# EAGLE design BMS Thermistor ECU rev2 (EAGLE 8.3.1)
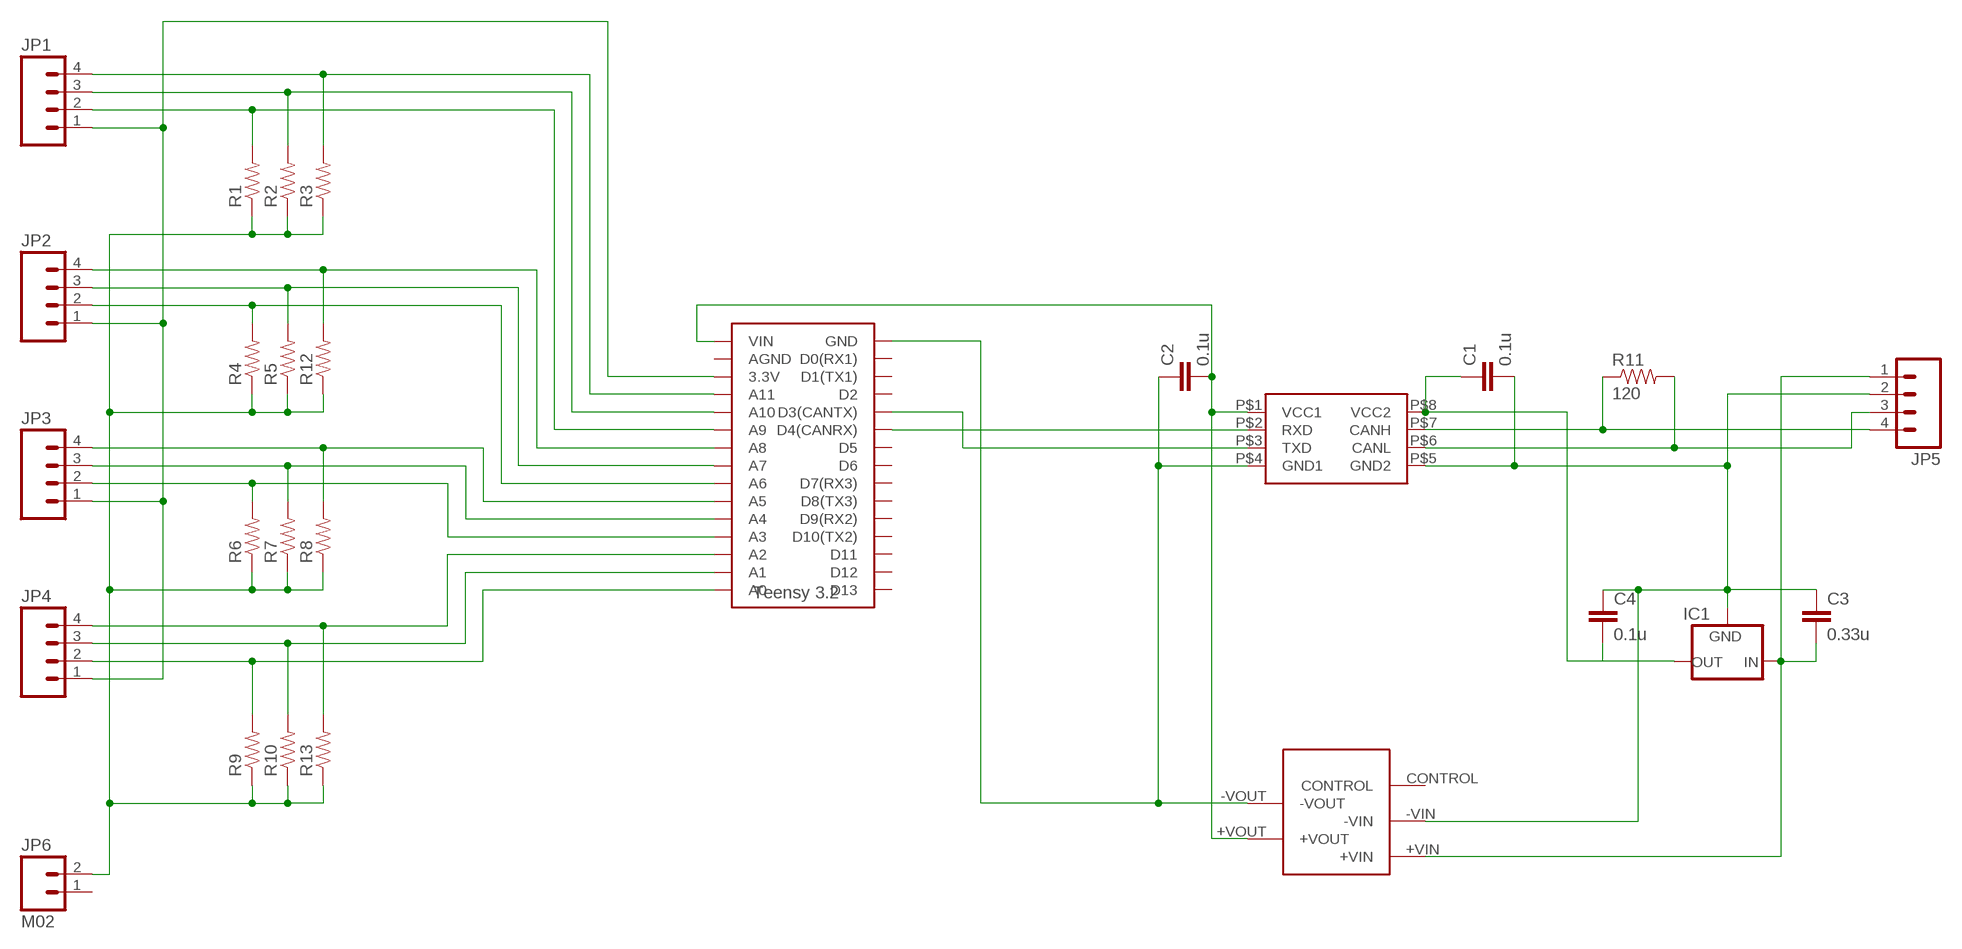
[diagram p0: schematic, sheet 1]

## Parts
C1  0.1u  CAP0805  [0805]
C2  0.1u  CAP0805  [0805]
C3  0.33u  CAP0805  [0805]
C4  0.1u  CAP0805  [0805]
IC1  5VREG_L7805SPACED  [TO-220-SPACED]
JP1  M04  [1X04]
JP2  M04  [1X04]
JP3  M04  [1X04]
JP4  M04  [1X04]
JP5  M04  [1X04]
JP6  M02  [1X02]
R1  RESISTOR0805-RES  [0805]
R2  RESISTOR0805-RES  [0805]
R3  RESISTOR0805-RES  [0805]
R4  RESISTOR0805-RES  [0805]
R5  RESISTOR0805-RES  [0805]
R6  RESISTOR0805-RES  [0805]
R7  RESISTOR0805-RES  [0805]
R8  RESISTOR0805-RES  [0805]
R9  RESISTOR0805-RES  [0805]
R10  RESISTOR0805-RES  [0805]
R11  120  RESISTOR0805-RES  [0805]
R12  RESISTOR0805-RES  [0805]
R13  RESISTOR0805-RES  [0805]
U$1  TEENSY_3.2_12ANALOG  [TEENSY_3.2_12ANALOG]
U$2  ISO1050CAN  [DUB8]
U$3  NCS1S1205SC-12V-5VCONVERTER  [DCDC-CONVERTER]

## Nets
3.3V: JP1.1 JP2.1 JP3.1 JP4.1 U$1.3.3V
N$1: C1.2 C3.1 C4.1 IC1.2(GND) JP5.2 U$2.P$5(GND2) U$3.-VIN
N$2: JP3.3 R7.2 U$1.A4
N$3: JP3.4 R8.2 U$1.A5
N$4: C3.2 IC1.1(IN) JP5.1 U$3.+VIN
N$5: C1.1 C4.2 IC1.3(OUT) U$2.P$8(VCC2)
N$6: JP5.4 R11.1 U$2.P$7(CANH)
N$7: JP5.3 R11.2 U$2.P$6(CANL)
N$8: U$1.D3(CANTX) U$2.P$3(TXD)
N$9: U$1.D4(CANRX) U$2.P$2(RXD)
N$10: C2.2 U$1.VIN U$2.P$1(VCC1) U$3.+VOUT
N$11: C2.1 U$1.GND U$2.P$4(GND1) U$3.-VOUT
N$12: JP2.4 R12.2 U$1.A8
N$13: JP4.4 R13.2 U$1.A2
THERM1: JP1.2 R1.2 U$1.A9
THERM2: JP1.3 R2.2 U$1.A10
THERM3: JP1.4 R3.2 U$1.A11
THERM4: JP2.2 R4.2 U$1.A6
THERM5: JP2.3 R5.2 U$1.A7
THERM6: JP3.2 R6.2 U$1.A3
THERM9: JP4.2 R9.2 U$1.A0
THERM10: JP4.3 R10.2 U$1.A1
TS_GND: JP6.2 R1.1 R2.1 R3.1 R4.1 R5.1 R6.1 R7.1 R8.1 R9.1 R10.1 R12.1 R13.1
Unconnected: JP6.1 U$1.AGND U$1.D0(RX1) U$1.D1(TX1) U$1.D2 U$1.D5 U$1.D6 U$1.D7(RX3) U$1.D8(TX3) U$1.D9(RX2) U$1.D10(TX2) U$1.D11 U$1.D12 U$1.D13 U$3.CONTROL

## Library data of the parts
C1-C4 = HyTechDevices:CAP: Capacitor Standard 0603 ceramic capacitor, and 0.1" leaded capacitor.
IC1 = HyTechDevices:5VREG_L7805: Voltage Regulator Switching 5v regulator Datasheet <http://power.murata.com/data/power/oki-78sr.pdf> Standard 7805 5V regulator. IGO (Input Ground Output). Spark Fun Electronics SKU : COM-00107 Datasheet <http://www.mouser.com/ds/2/308/MC7800-D-94905.pdf>
JP1-JP5 = HyTechDevices:M04: Standard 4-pin 0.1" header. NOTES ON THE VARIANTS LOCK and LOCK_LONGPADS... This footprint was designed to help hold the alignment of a through-hole component (i.e. 6-pin header) while soldering it into place. You may notice that each hole has been shifted either up or down by 0.005 of an inch from it's more standard position (which is a perfectly straight line). This slight alteration caused the pins (the squares in the middle) to touch the edges of the holes. Because they are alternating, it causes a "brace" to hold the component in place. 0.005 has proven to be the perfect amount of "off-center" position when using our standard breakaway headers. Although looks a little odd when you look at the bare footprint, once you have a header in there, the alteration is very hard to notice. Also,if you push a header all the way into place, it is covered up entirely on the bottom side. This idea of altering the position of holes to aid alignment will be further integrated into the Sparkfun Library for other footprints. It can help hold any component with 3 or more connection pins. Note: The Sparkfun version includes many other packages including surface mount that may be of future interest. Source: Sparkfun <https://github.com/sparkfun/SparkFun-Eagle-Libraries>
JP6 = HyTechDevices:M02: Standard 2-pin 0.1" header. NOTES ON THE VARIANTS LOCK and LOCK_LONGPADS... This footprint was designed to help hold the alignment of a through-hole component (i.e. 6-pin header) while soldering it into place. You may notice that each hole has been shifted either up or down by 0.005 of an inch from it's more standard position (which is a perfectly straight line). This slight alteration caused the pins (the squares in the middle) to touch the edges of the holes. Because they are alternating, it causes a "brace" to hold the component in place. 0.005 has proven to be the perfect amount of "off-center" position when using our standard breakaway headers. Although looks a little odd when you look at the bare footprint, once you have a header in there, the alteration is very hard to notice. Also,if you push a header all the way into place, it is covered up entirely on the bottom side. This idea of altering the position of holes to aid alignment will be further integrated into the Sparkfun Library for other footprints. It can help hold any component with 3 or more connection pins. Note: The Sparkfun version includes many other packages including surface mount that may be of future interest. Source: Sparkfun <https://github.com/sparkfun/SparkFun-Eagle-Libraries>
R1-R13 = HyTechDevices:RESISTOR: Resistor Basic schematic elements and footprints for 0603, 1206, and PTH resistors.
U$1 = HyTechDevices:TEENSY_3.2_12ANALOG
U$2 = HyTechDevices:ISO1050CAN
U$3 = HyTechDevices:NCS1S1205SC-12V-5VCONVERTER

## Board
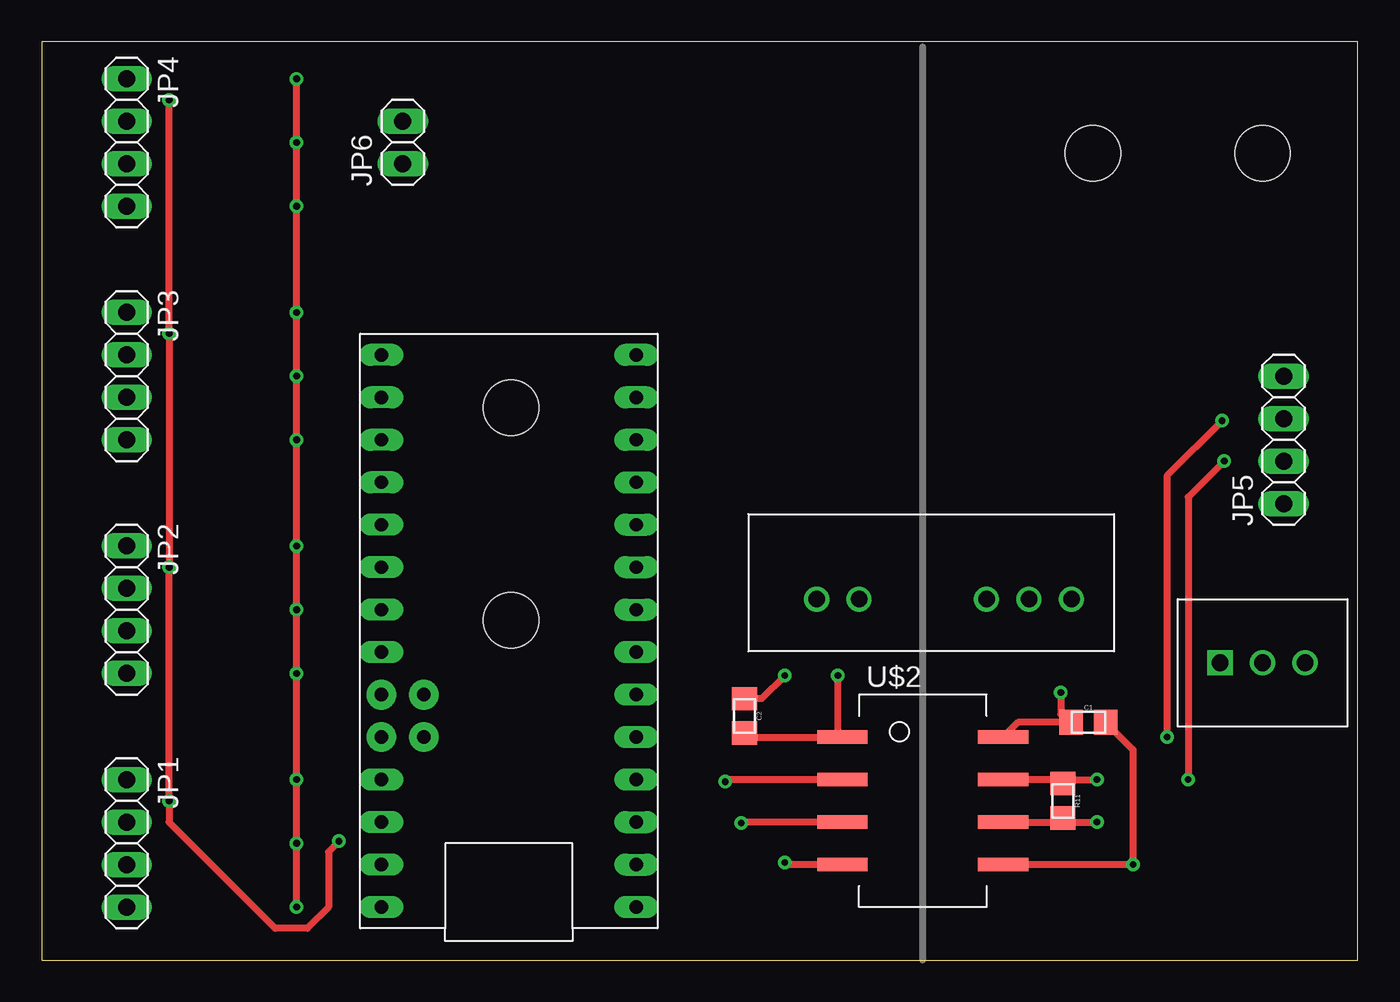
[diagram p1: board, top side]
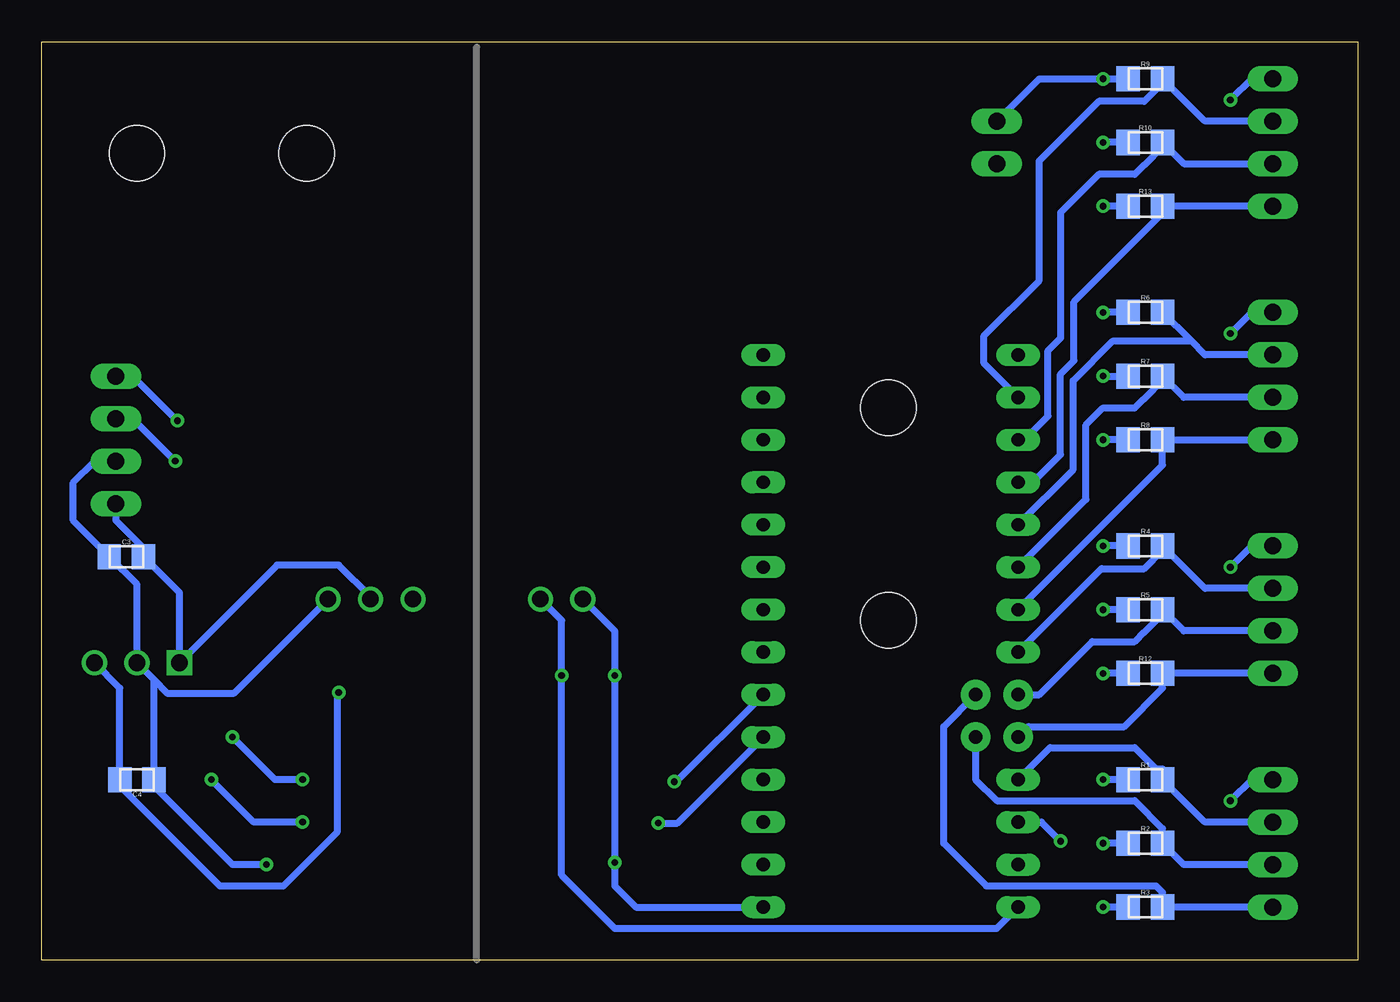
[diagram p2: board, bottom side, seen from below]

Size 78.72 x 54.91 mm. Coordinates in mm from the lower left corner, seen from the top.
Outline: 0,0 78.72,0 78.72,54.91 0,54.91 0,0
Copper layers (1*16): Top 0.035mm / dielectric 1.5mm / Bottom 0.035mm
Design rules "DRC Advanced Circuits": minimum track width 6mil, minimum drill 15mil, track to track 6mil, track to pad 6mil, pad to pad 6mil, via to via 6mil, smd to smd 6mil, copper to edge 40mil, drill to drill 6mil, minimum pad ring 10mil, minimum via ring 8mil, stop-mask expansion 4mil, vias tented up to drill 0mil, thermal gap 10mil
Holes 3.3 mm at 73.03,48.26 62.87,48.26 28.07,33.02 28.07,20.32

### Footprints (pad centres in the part's own frame; a part is rotated, then mirrored left to right if it is on the bottom)
0805 = smd 1.4 x 1.5: 1 -1.025,0; 2 1.025,0
TO-220-SPACED = drill 1 square: 1 -2.54,0 | drill 1: 2 0,0; 3 2.54,0
1X04 = drill 1.016 long: 1 -3.81,0; 2 -1.27,0; 3 1.27,0; 4 3.81,0
1X02 = drill 1.016 long: 1 -1.27,0; 2 1.27,0
TEENSY_3.2_12ANALOG = drill 0.8 long: 3.3V 16.51,29.21; A0 16.51,3.81; A1 16.51,6.35; A2 16.51,8.89; A3 16.51,11.43; A4 16.51,13.97; A5 16.51,16.51; A6 16.51,19.05; A9 16.51,26.67; AGND 16.51,31.75; D0(RX1) 1.27,31.75; D1(TX1) 1.27,29.21; D2 1.27,26.67; D3(CANTX) 1.27,24.13; D4(CANRX) 1.27,21.59; D5 1.27,19.05; D6 1.27,16.51; D7(RX3) 1.27,13.97; D8(TX3) 1.27,11.43; D9(RX2) 1.27,8.89; D10(TX2) 1.27,6.35; D11 1.27,3.81; D12 1.27,1.27; D13 16.51,1.27; GND 1.27,34.29; VIN 16.51,34.29 | drill 0.8 pad 1.778: A7 16.51,21.59; A8 16.51,24.13; A10 13.97,24.13; A11 13.97,21.59
DUB8 = smd 0.8 x 3: P$1 -3.81,-4.8; P$2 -1.27,-4.8; P$3 1.27,-4.8; P$4 3.81,-4.8; P$5 3.81,4.8; P$6 1.27,4.8; P$7 -1.27,4.8; P$8 -3.81,4.8
DCDC-CONVERTER = drill 0.991: +VIN -6.35,0; +VOUT 3.81,0; -VIN -8.89,0; -VOUT 6.35,0; CONTROL -3.81,0

### Placement (x,y rotation side)
C1  62.61,14.22 0 top
C2  42.04,14.61 270 top
C3  73.66,24.13 0 bottom
C4  73.03,10.79 180 bottom
IC1  73.03,17.78 0 top
JP1  5.08,6.99 270 top
JP2  5.08,20.95 270 top
JP3  5.08,34.92 270 top
JP4  5.08,48.9 270 top
JP5  74.3,31.11 90 top
JP6  21.59,48.9 90 top
R1  12.7,10.79 0 bottom
R2  12.7,6.99 0 bottom
R3  12.7,3.17 0 bottom
R4  12.7,24.77 0 bottom
R5  12.7,20.95 0 bottom
R6  12.7,38.73 0 bottom
R7  12.7,34.92 0 bottom
R8  12.7,31.11 0 bottom
R9  12.7,52.7 0 bottom
R10  12.7,48.9 0 bottom
R11  61.09,9.53 270 top
R12  12.7,17.14 0 bottom
R13  12.7,45.09 0 bottom
U$1  36.83,37.47 180 top
U$2  52.7,9.53 270 top
U$3  52.7,21.59 180 top

### Tracks (layer width: path | path; a pad name or v marks a point on that pad's centre or on a via)
3.3V  (via drill 0.4)
  Top 0.406: v7.62,51.44 v7.62,37.47 v7.62,23.5 v7.62,9.53 7.62,8.26 13.97,1.91 15.88,1.91 17.14,3.17 17.14,6.48 v17.78,7.11
  Bottom 0.406: JP4.1 6.35,52.7 v7.62,51.44 | JP3.1 6.35,38.73 v7.62,37.47 | JP2.1 6.35,24.77 v7.62,23.5 | JP1.1 6.35,10.79 v7.62,9.53 | U$1.3.3V 18.92,8.26 v17.78,7.11
N$1  (via drill 0.4)
  Top 0.406: C1.2 65.28,12.58 v65.28,5.71 U$2.P$5
  Bottom 0.406: JP5.2 75.56,29.84 76.83,28.57 76.83,26.28 C3.1 73.03,22.47 IC1.2 72,16.75 | v65.28,5.71 67.31,5.71 72,10.4 C4.1 72,16.75 | 72,16.75 71.18,15.94 67.25,15.94 U$3.-VIN
N$2
  Bottom 0.406: JP3.3 10.4,33.66 R7.2 11.68,34.66 12.77,33.56 12.79,33.56 13.34,33.02 15.24,33.02 16.26,32 16.26,27.56 U$1.A4
N$3
  Bottom 0.406: JP3.4 R8.2 11.68,29.6 U$1.A5
N$4
  Bottom 0.406: JP5.1 74.3,26.3 72.64,24.64 C3.2 70.48,21.98 IC1.1 64.64,23.62 60.96,23.62 59.05,21.72 U$3.+VIN
N$5  (via drill 0.4)
  Top 0.406: 61.47,14.22 58.39,14.22 U$2.P$8 | 61.47,14.22 C1.1 | v60.96,16 60.96,14.73 61.47,14.22
  Bottom 0.406: IC1.3 74.05,16.27 C4.2 74.05,10.42 68.07,4.45 64.26,4.45 61.02,7.68 61.02,15.94 v60.96,16
N$6  (via drill 0.4)
  Top 0.406: v63.12,10.79 61.33,10.79 R11.1 60.84,10.79 U$2.P$7 | v67.31,13.34 67.31,28.96 v70.61,32.26
  Bottom 0.406: v63.12,10.79 64.77,10.79 v67.31,13.34 | JP5.4 73.28,34.92 v70.61,32.26
N$7  (via drill 0.4)
  Top 0.406: v63.12,8.26 61.33,8.26 R11.2 60.84,8.26 U$2.P$6 | v68.58,10.79 68.58,27.69 v70.74,29.84
  Bottom 0.406: v63.12,8.26 66.04,8.26 v68.58,10.79 | JP5.3 73.28,32.38 v70.74,29.84
N$8  (via drill 0.4)
  Top 0.406: U$2.P$3 41.91,8.26 v41.85,8.19
  Bottom 0.406: v41.85,8.19 40.7,8.19 U$1.D3(CANTX)
N$9  (via drill 0.4)
  Top 0.406: U$2.P$2 41.02,10.79 v40.89,10.67
  Bottom 0.406: v40.89,10.67 40.77,10.67 U$1.D4(CANRX)
N$10  (via drill 0.4)
  Top 0.406: C2.2 42.28,13.34 U$2.P$1 47.62,13.62 v47.62,17.02
  Bottom 0.406: U$1.VIN 21.59,1.91 44.45,1.91 47.62,5.08 v47.62,17.02 47.62,20.32 U$3.+VOUT
N$11  (via drill 0.4)
  Top 0.406: v44.45,17.02 43.06,15.63 C2.1 | U$2.P$4 44.58,5.71 v44.45,5.84
  Bottom 0.406: U$1.GND 43.18,3.17 44.45,4.45 v44.45,5.84 v44.45,17.02 44.45,19.68 U$3.-VOUT
N$12
  Bottom 0.406: JP2.4 R12.2 11.68,16.27 13.97,13.97 19.68,13.97 U$1.A8
N$13
  Bottom 0.406: JP4.4 R13.2 11.68,44.66 16.97,39.37 16.97,35.85 17.78,35.04 17.78,30.23 19.43,28.57 U$1.A2
THERM1
  Bottom 0.406: JP1.2 9.13,8.26 R1.2 11.68,11.43 12.06,11.43 13.34,12.7 18.41,12.7 U$1.A9
THERM2
  Bottom 0.406: JP1.3 10.4,5.71 R2.2 11.68,7.87 13.34,9.53 21.6,9.53 22.86,10.79 U$1.A10
THERM3
  Bottom 0.406: JP1.4 R3.2 11.68,4.05 12.06,4.45 22.23,4.45 24.77,6.99 24.77,13.97 U$1.A11
THERM4
  Bottom 0.406: JP2.2 9.13,22.23 R4.2 11.68,24.5 12.77,23.41 15.33,23.41 U$1.A6
THERM5
  Bottom 0.406: JP2.3 10.4,19.68 R5.2 11.68,20.69 12.77,19.59 12.79,19.59 13.34,19.05 15.88,19.05 19.05,15.88 U$1.A7
THERM6
  Bottom 0.406: JP3.2 9.13,36.2 9.96,37.02 | 9.96,37.02 R6.2 | 9.96,37.02 14.64,37.02 17.02,34.65 17.02,29.34 U$1.A3
THERM9
  Bottom 0.406: JP4.2 9.13,50.16 R9.2 11.68,52.44 12.77,51.34 15.49,51.34 19.05,47.79 19.05,40.64 22.35,37.34 22.35,35.69 U$1.A0
THERM10
  Bottom 0.406: JP4.3 10.4,47.62 R10.2 11.68,48.63 12.77,47.53 12.79,47.53 13.34,46.99 15.49,46.99 17.78,44.7 17.78,37.19 18.53,36.44 18.53,32.52 19.94,31.11 U$1.A1
TS_GND  (via drill 0.4)
  Top 0.406: v15.24,3.17 v15.24,6.99 v15.24,10.79 v15.24,17.14 v15.24,20.95 v15.24,24.77 v15.24,31.11 v15.24,34.92 v15.24,38.73 v15.24,45.09 v15.24,48.9 v15.24,52.7
  Bottom 0.406: R9.1 v15.24,52.7 19.05,52.7 JP6.2 | R10.1 v15.24,48.9 | R13.1 v15.24,45.09 | R6.1 v15.24,38.73 | R8.1 v15.24,31.11 | R4.1 v15.24,24.77 | R5.1 v15.24,20.95 | R12.1 v15.24,17.14 | R1.1 v15.24,10.79 | R2.1 v15.24,6.99 | R3.1 v15.24,3.17 | v15.24,34.92 R7.1

### Text on the board
tDocu: BMS Thermistor ECU rev2 | GLV | TS | Designed by Parker Jones | DANGER / HIGH VOLTAGE BOARD AREA | TS | GLV | TS | GLV
bDocu: TS | GLV | DANGER / HIGH VOLTAGE BOARD AREA | TS | GLV | TS | GLV